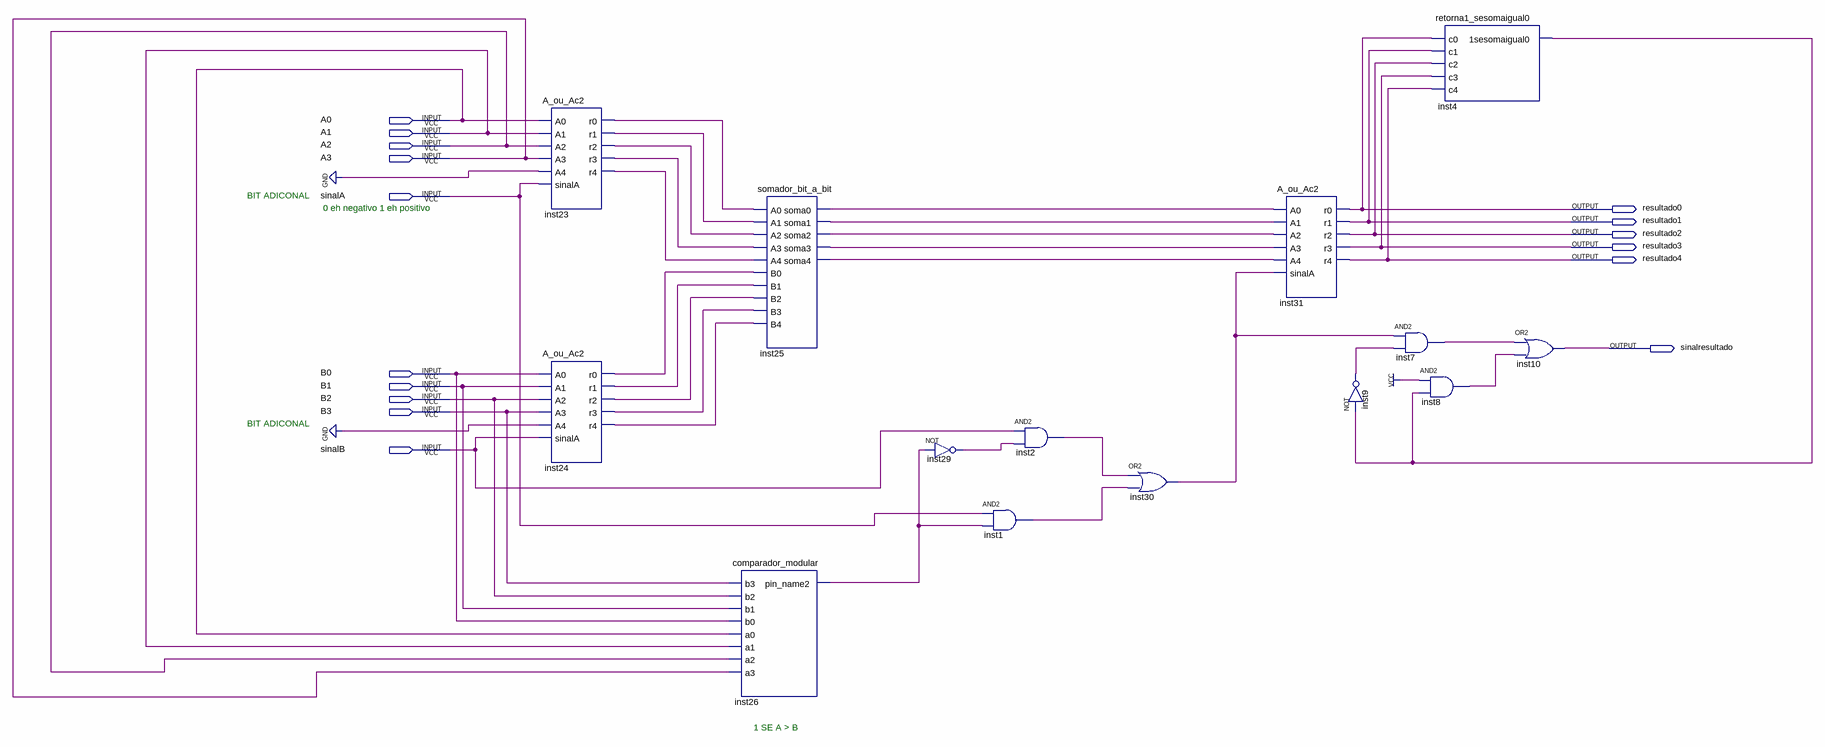
[diagram p0: schematic sheet]
// Quartus schematic soma.bdf as structural Verilog: 14 symbols, 16 pins
module soma (
  input  A0,
  input  A1,
  input  A2,
  input  A3,
  input  sinalA,
  input  B0,
  input  B1,
  input  B2,
  input  B3,
  input  sinalB,
  output resultado0,
  output resultado1,
  output resultado2,
  output resultado3,
  output resultado4,
  output sinalresultado
);

  wire inst1_out, inst2_out, inst4_1sesomaigual0, inst7_out, inst8_out, inst9_out, inst23_r0, inst23_r1,
       inst23_r2, inst23_r3, inst23_r4, inst24_r0, inst24_r1, inst24_r2, inst24_r3, inst24_r4, inst25_soma0,
       inst25_soma1, inst25_soma2, inst25_soma3, inst25_soma4, inst26_pin_name2, inst29_out, inst30_out;

  A_ou_Ac2 inst23 (
    .A0(A0), .A1(A1), .A2(A2), .A3(A3), .A4(1'b0), .sinalA(sinalA), .r0(inst23_r0), .r1(inst23_r1),
    .r2(inst23_r2), .r3(inst23_r3), .r4(inst23_r4));
  A_ou_Ac2 inst24 (
    .A0(B0), .A1(B1), .A2(B2), .A3(B3), .A4(1'b0), .sinalA(sinalB), .r0(inst24_r0), .r1(inst24_r1),
    .r2(inst24_r2), .r3(inst24_r3), .r4(inst24_r4));
  comparador_modular inst26 (
    .b3(B3), .b2(B2), .b1(B1), .b0(B0), .a0(A0), .a1(A1), .a2(A2), .a3(A3), .pin_name2(inst26_pin_name2));
  somador_bit_a_bit inst25 (
    .A0(inst23_r0), .A1(inst23_r1), .A2(inst23_r2), .A3(inst23_r3), .A4(inst23_r4), .B0(inst24_r0),
    .B1(inst24_r1), .B2(inst24_r2), .B3(inst24_r3), .B4(inst24_r4), .soma0(inst25_soma0),
    .soma1(inst25_soma1), .soma2(inst25_soma2), .soma3(inst25_soma3), .soma4(inst25_soma4));
  not inst29 (inst29_out, inst26_pin_name2);
  and inst1 (inst1_out, sinalA, inst26_pin_name2);
  and inst2 (inst2_out, sinalB, inst29_out);
  or inst30 (inst30_out, inst2_out, inst1_out);
  A_ou_Ac2 inst31 (
    .A0(inst25_soma0), .A1(inst25_soma1), .A2(inst25_soma2), .A3(inst25_soma3), .A4(inst25_soma4),
    .sinalA(inst30_out), .r0(resultado0), .r1(resultado1), .r2(resultado2), .r3(resultado3), .r4(resultado4));
  not inst9 (inst9_out, inst4_1sesomaigual0);
  and inst7 (inst7_out, inst30_out, inst9_out);
  retorna1_sesomaigual0 inst4 (
    .c0(resultado0), .c1(resultado1), .c2(resultado2), .c3(resultado3), .c4(resultado4),
    .\1sesomaigual0 (inst4_1sesomaigual0));
  and inst8 (inst8_out, 1'b1, inst4_1sesomaigual0);
  or inst10 (sinalresultado, inst7_out, inst8_out);

  // Notes on the sheet:
  //   BIT ADICONAL
  //   0 eh negativo 1 eh positivo
  //   BIT ADICONAL
  //   1 SE A > B
endmodule
